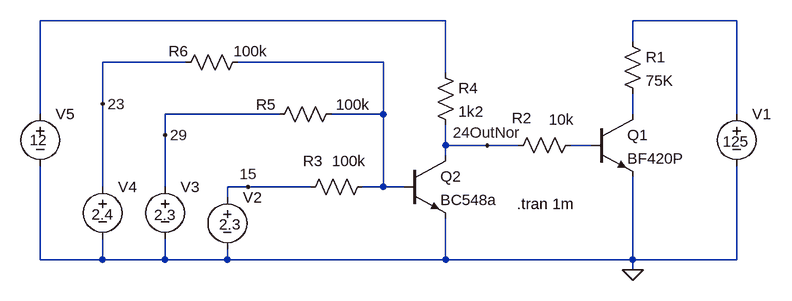
[diagram p0: schematic DiscrNorForLG1465.asc]
DiscrNorForLG1465.asc, the LTspice schematic file:
Version 4
SHEET 1 880 680
WIRE -880 256 -880 112
WIRE -880 480 -880 336
WIRE -784 240 -784 176
WIRE -784 368 -784 240
WIRE -784 480 -880 480
WIRE -784 480 -784 448
WIRE -688 288 -688 256
WIRE -688 368 -688 288
WIRE -688 480 -784 480
WIRE -688 480 -688 448
WIRE -656 176 -784 176
WIRE -592 384 -592 368
WIRE -592 480 -688 480
WIRE -592 480 -592 464
WIRE -560 368 -592 368
WIRE -512 256 -688 256
WIRE -464 368 -560 368
WIRE -352 176 -576 176
WIRE -352 256 -432 256
WIRE -352 256 -352 176
WIRE -352 368 -384 368
WIRE -352 368 -352 256
WIRE -320 368 -352 368
WIRE -256 112 -880 112
WIRE -256 192 -256 112
WIRE -256 304 -256 272
WIRE -256 320 -256 304
WIRE -256 480 -592 480
WIRE -256 480 -256 416
WIRE -192 304 -256 304
WIRE -144 304 -192 304
WIRE -32 304 -64 304
WIRE 32 144 32 112
WIRE 32 256 32 224
WIRE 32 480 -256 480
WIRE 32 480 32 352
WIRE 32 496 32 480
WIRE 192 112 32 112
WIRE 192 256 192 112
WIRE 192 480 32 480
WIRE 192 480 192 336
FLAG 32 496 0
FLAG -192 304 24OutNor
FLAG -784 240 23
FLAG -688 288 29
FLAG -560 368 15
SYMBOL npn2 -32 256 R0
SYMATTR InstName Q1
SYMATTR Value BF420P
SYMBOL res 16 128 R0
SYMATTR InstName R1
SYMATTR Value 75K
SYMATTR SpiceLine tol=1 pwr=0.1
SYMBOL res -48 288 R90
WINDOW 0 -26 75 VRight 0
WINDOW 3 -24 10 VRight 0
SYMATTR InstName R2
SYMATTR Value 10k
SYMATTR SpiceLine tol=1 pwr=0.1
SYMBOL voltage 192 240 R0
WINDOW 3 -21 58 Left 0
WINDOW 123 0 0 Left 0
WINDOW 39 0 0 Left 0
SYMATTR Value 125
SYMATTR InstName V1
SYMBOL npn2 -320 320 R0
SYMATTR InstName Q2
SYMATTR Value BC548a
SYMBOL res -368 352 R90
WINDOW 0 -24 77 VRight 0
WINDOW 3 -24 10 VRight 0
SYMATTR InstName R3
SYMATTR Value 100k
SYMATTR SpiceLine tol=1 pwr=0.1
SYMBOL voltage -592 368 R0
WINDOW 3 -13 58 Left 0
WINDOW 123 0 0 Left 0
WINDOW 39 0 0 Left 0
SYMATTR Value 2.3
SYMATTR InstName V2
SYMBOL res -272 176 R0
SYMATTR InstName R4
SYMATTR Value 1k2
SYMATTR SpiceLine tol=1 pwr=0.1
SYMBOL res -416 240 R90
WINDOW 0 1 101 VRight 0
WINDOW 3 1 -44 VRight 0
SYMATTR InstName R5
SYMATTR Value 100k
SYMATTR SpiceLine tol=1 pwr=0.1
SYMBOL voltage -688 352 R0
WINDOW 3 -17 59 Left 0
WINDOW 123 0 0 Left 0
WINDOW 39 0 0 Left 0
SYMATTR Value 2.3
SYMATTR InstName V3
SYMBOL res -560 160 R90
WINDOW 0 -1 92 VRight 0
WINDOW 3 -1 -30 VRight 0
SYMATTR InstName R6
SYMATTR Value 100k
SYMATTR SpiceLine tol=1 pwr=0.1
SYMBOL voltage -784 352 R0
WINDOW 3 -17 58 Left 0
WINDOW 123 0 0 Left 0
WINDOW 39 0 0 Left 0
SYMATTR Value 2.4
SYMATTR InstName V4
SYMBOL voltage -880 240 R0
WINDOW 3 -16 56 Left 0
WINDOW 123 0 0 Left 0
WINDOW 39 0 0 Left 0
SYMATTR Value 12
SYMATTR InstName V5
TEXT -146 394 Left 0 !.tran 1m

The netlist it stands for:
* DiscrNorForLG1465.asc
Q1 N005 N003 0 0 BF420P
R1 N004 N005 75K tol=1 pwr=0.1
R2 N003 24OutNor 10k tol=1 pwr=0.1
V1 N004 0 125
Q2 24OutNor N002 0 0 BC548a
R3 N002 15 100k tol=1 pwr=0.1
V2 15 0 2.3
R4 N001 24OutNor 1k2 tol=1 pwr=0.1
R5 N002 29 100k tol=1 pwr=0.1
V3 29 0 2.3
R6 N002 23 100k tol=1 pwr=0.1
V4 23 0 2.4
V5 N001 0 12
.model NPN NPN
.model PNP PNP
.lib standard.bjt
.tran 1m
.backanno
.end